# Altium schematic sheet FPGA_Schematic.SchDoc
size B; SheetNumber: 3; SheetTotal: 3
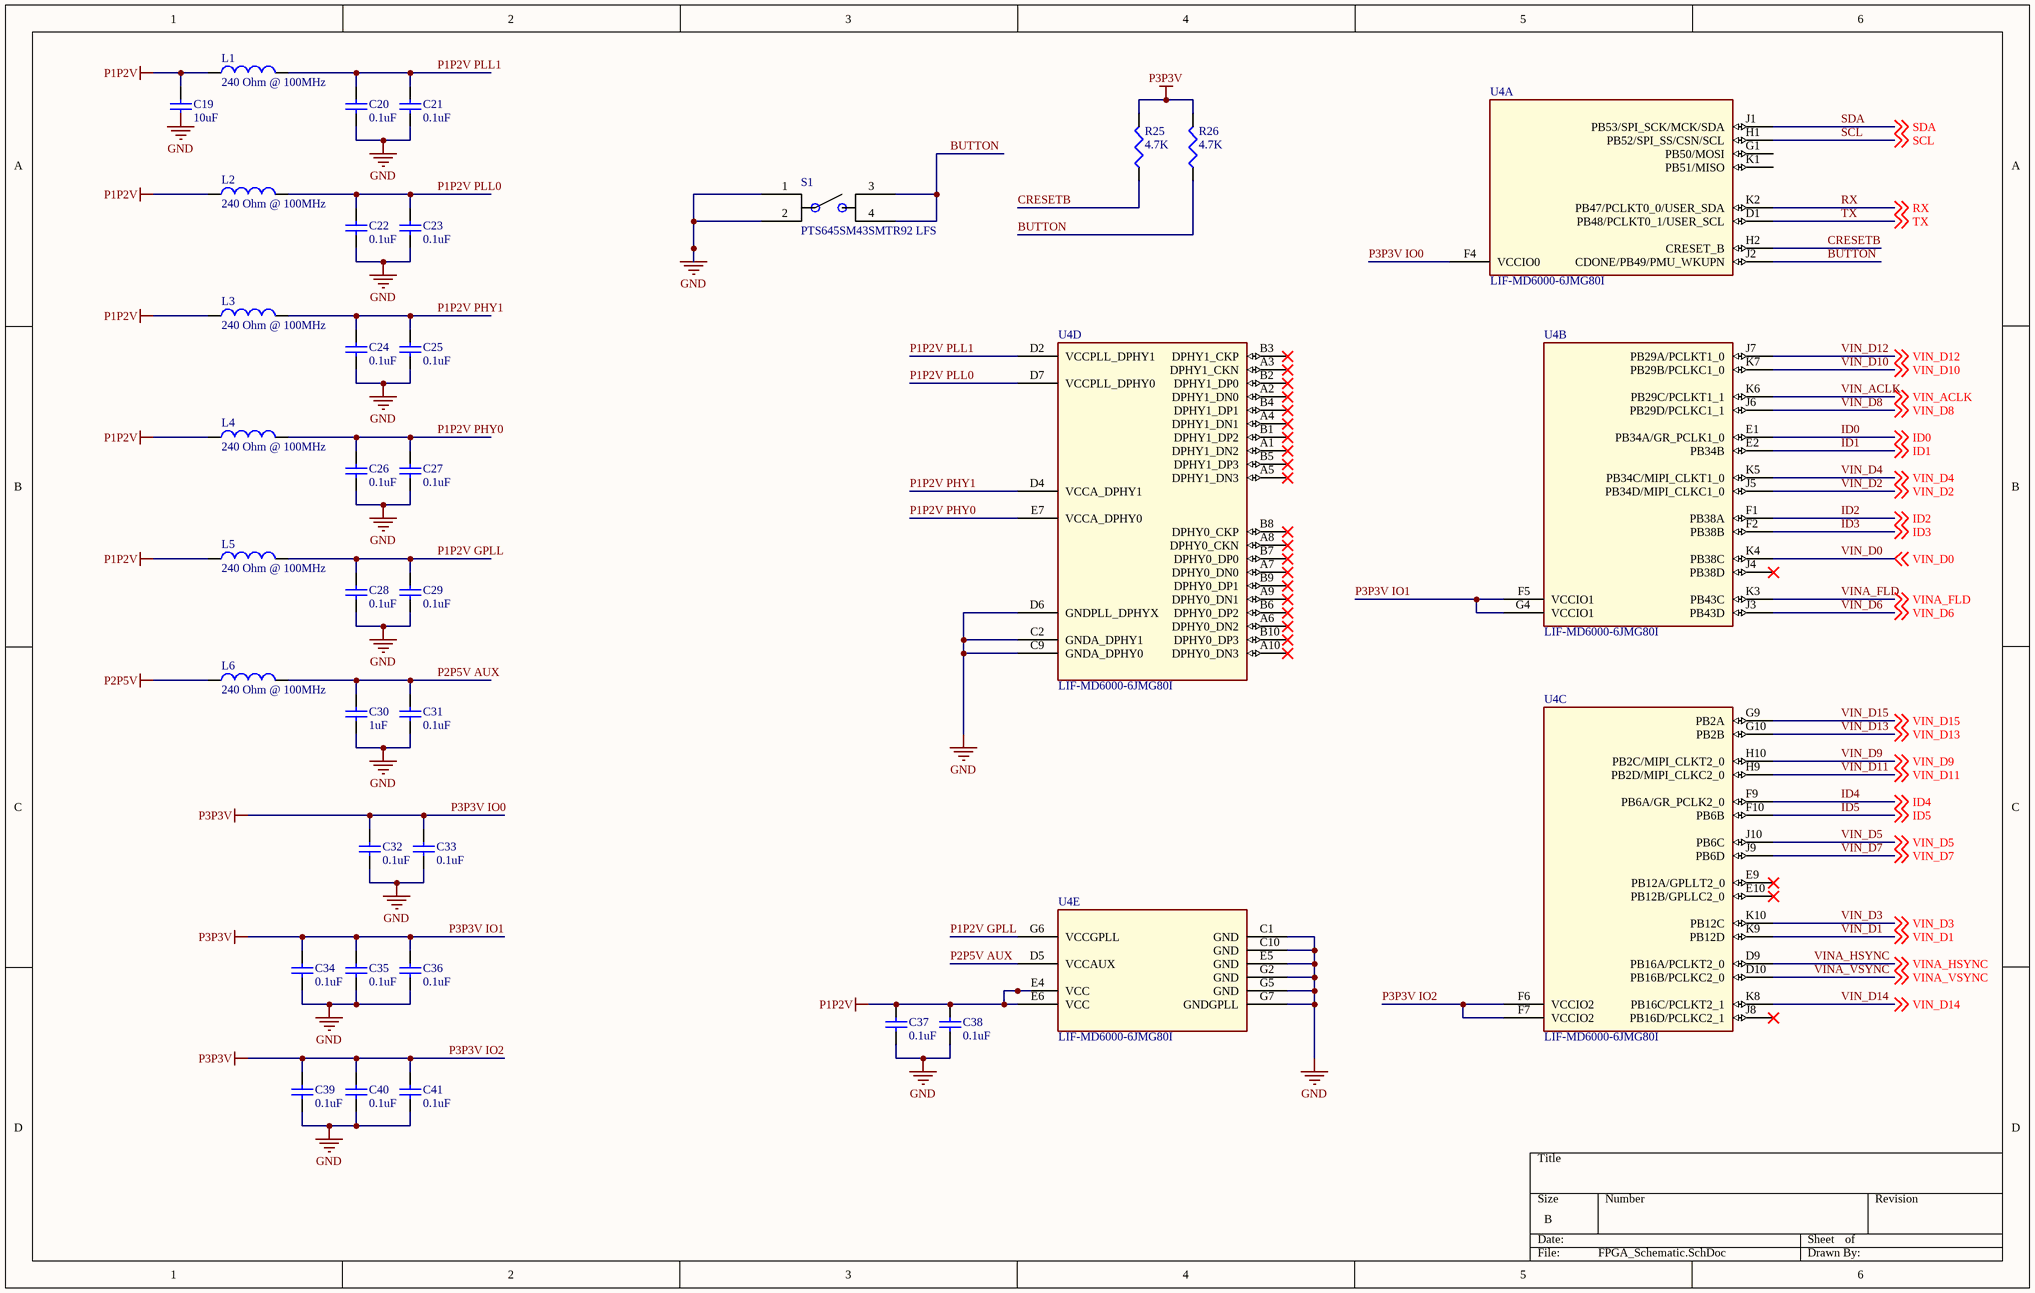
[diagram p0: FPGA_Schematic.SchDoc]

## Parts
C19  10uF  [CAPC0603X33N]
C20  0.1uF  [CAPC0603X33N]
C21  0.1uF  [CAPC0603X33N]
C22  0.1uF  [CAPC0603X33N]
C23  0.1uF  [CAPC0603X33N]
C24  0.1uF  [CAPC0603X33N]
C25  0.1uF  [CAPC0603X33N]
C26  0.1uF  [CAPC0603X33N]
C27  0.1uF  [CAPC0603X33N]
C28  0.1uF  [CAPC0603X33N]
C29  0.1uF  [CAPC0603X33N]
C30  1uF  [CAPC0603X33N]
C31  0.1uF  [CAPC0603X33N]
C32  0.1uF  [CAPC0603X33N]
C33  0.1uF  [CAPC0603X33N]
C34  0.1uF  [CAPC0603X33N]
C35  0.1uF  [CAPC0603X33N]
C36  0.1uF  [CAPC0603X33N]
C37  0.1uF  [INDC1005X45]
C38  0.1uF  [INDC1005X45]
C39  0.1uF  [CAPC0603X33N]
C40  0.1uF  [CAPC0603X33N]
C41  0.1uF  [CAPC0603X33N]
L1  240 Ohm @ 100MHz  [IND_LQP03HQ4N5J02D]
L2  240 Ohm @ 100MHz  [IND_LQP03HQ4N5J02D]
L3  240 Ohm @ 100MHz  [IND_LQP03HQ4N5J02D]
L4  240 Ohm @ 100MHz  [IND_LQP03HQ4N5J02D]
L5  240 Ohm @ 100MHz  [IND_LQP03HQ4N5J02D]
L6  240 Ohm @ 100MHz  [IND_LQP03HQ4N5J02D]
R25  4.7K  [RES_ERJU02F1241X]
R26  4.7K  [RES_ERJU02F1241X]
S1  PTS645SM43SMTR92 LFS  [SWITCH_43SMTR92LFS]
U4  LIF-MD6000-6JMG80I  [BGA80C65P10X10_650X650X100N]  (parts A,B,C,D,E of 5)

## Nets
GND: C20.1 C21.1 C22.1 C23.1 C24.1 C25.1 C26.1 C27.1 C28.1 C29.1 C30.1 C31.1 C32.1 C33.1 C34.1 C35.1 C36.1 C37.1 C38.1 C39.1 C40.1 C41.1 S1.1 S1.2 U4.C1(GND) U4.C2(GNDA_DPHY1) U4.C9(GNDA_DPHY0) U4.C10(GND) U4.D6(GNDPLL_DPHYX) U4.E5(GND) U4.G2(GND) U4.G5(GND) U4.G7(GNDGPLL)
P1P2V: C19.2 C37.2 C38.2 L1.1 L2.1 L3.1 L4.1 L5.1 U4.E4(VCC) U4.E6(VCC)
P2P5V: L6.1
P3P3V IO0: C32.2 C33.2 C34.2 C35.2 C36.2 C39.2 C40.2 C41.2 R25.2 R26.2 U4.F4(VCCIO0) U4.F5(VCCIO1) U4.F6(VCCIO2) U4.F7(VCCIO2) U4.G4(VCCIO1)  [also labelled P3P3V, P3P3V IO1, P3P3V IO2]
BUTTON: R26.1 S1.3 S1.4 U4.J2(CDONE/PB49/PMU_WKUPN)
CRESETB: R25.1 U4.H2(CRESET_B)
ID0: U4.E1(PB34A/GR_PCLK1_0) ; off-sheet ID0
ID1: U4.E2(PB34B) ; off-sheet ID1
ID2: U4.F1(PB38A) ; off-sheet ID2
ID3: U4.F2(PB38B) ; off-sheet ID3
ID4: U4.F9(PB6A/GR_PCLK2_0) ; off-sheet ID4
ID5: U4.F10(PB6B) ; off-sheet ID5
P1P2V GPLL: C28.2 C29.2 L5.2 U4.G6(VCCGPLL)
P1P2V PHY0: C26.2 C27.2 L4.2 U4.E7(VCCA_DPHY0)
P1P2V PHY1: C24.2 C25.2 L3.2 U4.D4(VCCA_DPHY1)
P1P2V PLL0: C22.2 C23.2 L2.2 U4.D7(VCCPLL_DPHY0)
P1P2V PLL1: C20.2 C21.2 L1.2 U4.D2(VCCPLL_DPHY1)
P2P5V AUX: C30.2 C31.2 L6.2 U4.D5(VCCAUX)
RX: U4.K2(PB47/PCLKT0_0/USER_SDA) ; off-sheet RX
SCL: U4.H1(PB52/SPI_SS/CSN/SCL) ; off-sheet SCL
SDA: U4.J1(PB53/SPI_SCK/MCK/SDA) ; off-sheet SDA
TX: U4.D1(PB48/PCLKT0_1/USER_SCL) ; off-sheet TX
VIN_ACLK: U4.K6(PB29C/PCLKT1_1) ; off-sheet VIN_ACLK
VIN_D0: U4.K4(PB38C) ; off-sheet VIN_D0
VIN_D1: U4.K9(PB12D) ; off-sheet VIN_D1
VIN_D2: U4.J5(PB34D/MIPI_CLKC1_0) ; off-sheet VIN_D2
VIN_D3: U4.K10(PB12C) ; off-sheet VIN_D3
VIN_D4: U4.K5(PB34C/MIPI_CLKT1_0) ; off-sheet VIN_D4
VIN_D5: U4.J10(PB6C) ; off-sheet VIN_D5
VIN_D6: U4.J3(PB43D) ; off-sheet VIN_D6
VIN_D7: U4.J9(PB6D) ; off-sheet VIN_D7
VIN_D8: U4.J6(PB29D/PCLKC1_1) ; off-sheet VIN_D8
VIN_D9: U4.H10(PB2C/MIPI_CLKT2_0) ; off-sheet VIN_D9
VIN_D10: U4.K7(PB29B/PCLKC1_0) ; off-sheet VIN_D10
VIN_D11: U4.H9(PB2D/MIPI_CLKC2_0) ; off-sheet VIN_D11
VIN_D12: U4.J7(PB29A/PCLKT1_0) ; off-sheet VIN_D12
VIN_D13: U4.G10(PB2B) ; off-sheet VIN_D13
VIN_D14: U4.K8(PB16C/PCLKT2_1) ; off-sheet VIN_D14
VIN_D15: U4.G9(PB2A) ; off-sheet VIN_D15
VINA_FLD: U4.K3(PB43C) ; off-sheet VINA_FLD
VINA_HSYNC: U4.D9(PB16A/PCLKT2_0) ; off-sheet VINA_HSYNC
VINA_VSYNC: U4.D10(PB16B/PCLKC2_0) ; off-sheet VINA_VSYNC

Not connected (* = marked no-connect by the designer): C19 1; U4 A1(DPHY1_DN2)* A2(DPHY1_DN0)* A3(DPHY1_CKN)* A4(DPHY1_DN1)* A5(DPHY1_DN3)* A6(DPHY0_DN2)* A7(DPHY0_DN0)* A8(DPHY0_CKN)* A9(DPHY0_DN1)* A10(DPHY0_DN3)* B1(DPHY1_DP2)* B2(DPHY1_DP0)* B3(DPHY1_CKP)* B4(DPHY1_DP1)* B5(DPHY1_DP3)* B6(DPHY0_DP2)* B7(DPHY0_DP0)* B8(DPHY0_CKP)* B9(DPHY0_DP1)* B10(DPHY0_DP3)* E9(PB12A/GPLLT2_0)* E10(PB12B/GPLLC2_0)* G1(PB50/MOSI) J4(PB38D)* J8(PB16D/PCLKC2_1)* K1(PB51/MISO)

## Notes on the sheet
- Labels drawn without touching a wire or pin: GND

## Library data of the parts
C19 = CMP-00647-A.1: CAP CER 10UF 6.3V X5R 0402; MfgPartNo: GRM155R60J106ME47D; Type: Ceramic - X5R; Mfg: Murata; Package: 0402; Capacitance: 10uF
C20-C29 C31-C41 = CMP-00496-A.6: CAP CER 0.1UF 25V X7R 0402; SLA Part No: SL00150; MfgPartNo: C1005X7R1E104K; Mfg: TDK; Type: Ceramic - X7R; Capacitance: 0.1uF; Package: 402
C30 = CMP-00695-A.2: CAP CER 1UF 25V X5R 0402; MfgPartNo: EMK105BJ105KV-F; Mfg: Taiyo Yuden; Type: Ceramic - X5R; Package: 402; Capacitance: 1uF; Component Type: Capacitor
L1-L6 = CMP-00665-A.1: BLM03BD241SN1D FERRITE BEAD 240 OHM 0201 1LN; Mfg: Murata; Rated Current: 200mA; Inductance: 240 Ohm @ 100MHz; Package: 0201; MfgPartNo: BLM03BD241SN1D; HelpURL: https://www.digikey.com/product-detail/en/murata-electronics-north-america/BLM03BD241SN1D/490-5173-1-ND/1948349
R25 R26 = CMP-00761-A.1: RES SMD 4K7 OHM 1% 1/16W 0402; MfgPartNo: RC0402FR-074K7P; Mfg: Yageo; Resistance: 4.7K; Package: 402; Component Type: Resistor
S1 = CMP-00660-2: PTS645SM43SMTR92 LFS SWITCH TACTILE SPST-NO 0.05A 12V; Mfg: C&K; HelpURL: https://www.digikey.com/product-detail/en/c-k/PTS645SM43SMTR92-LFS/CKN9112CT-ND/1146934; Package: SMT; MfgPartNo: PTS645SM43SMTR92 LFS
U4 = CMP-00644-A.1: LIF-MD6000-6JMG80I LATTICE CROSSLINK - INTERFACE MIPI D-; MfgPartNo: LIF-MD6000-6JMG80I; Package: 80-CTFBGA; Mfg: Lattice; HelpURL: https://www.digikey.com/products/en/integrated-circuits-ics/embedded-fpgas-field-programmable-gate-array/696?k=lif-md&k=&pkeyword=lif-md&pv16=5352&pv1291=10039&FV=ffe002b8&quantity=0&ColumnSort=0&page=1&pageSize=25